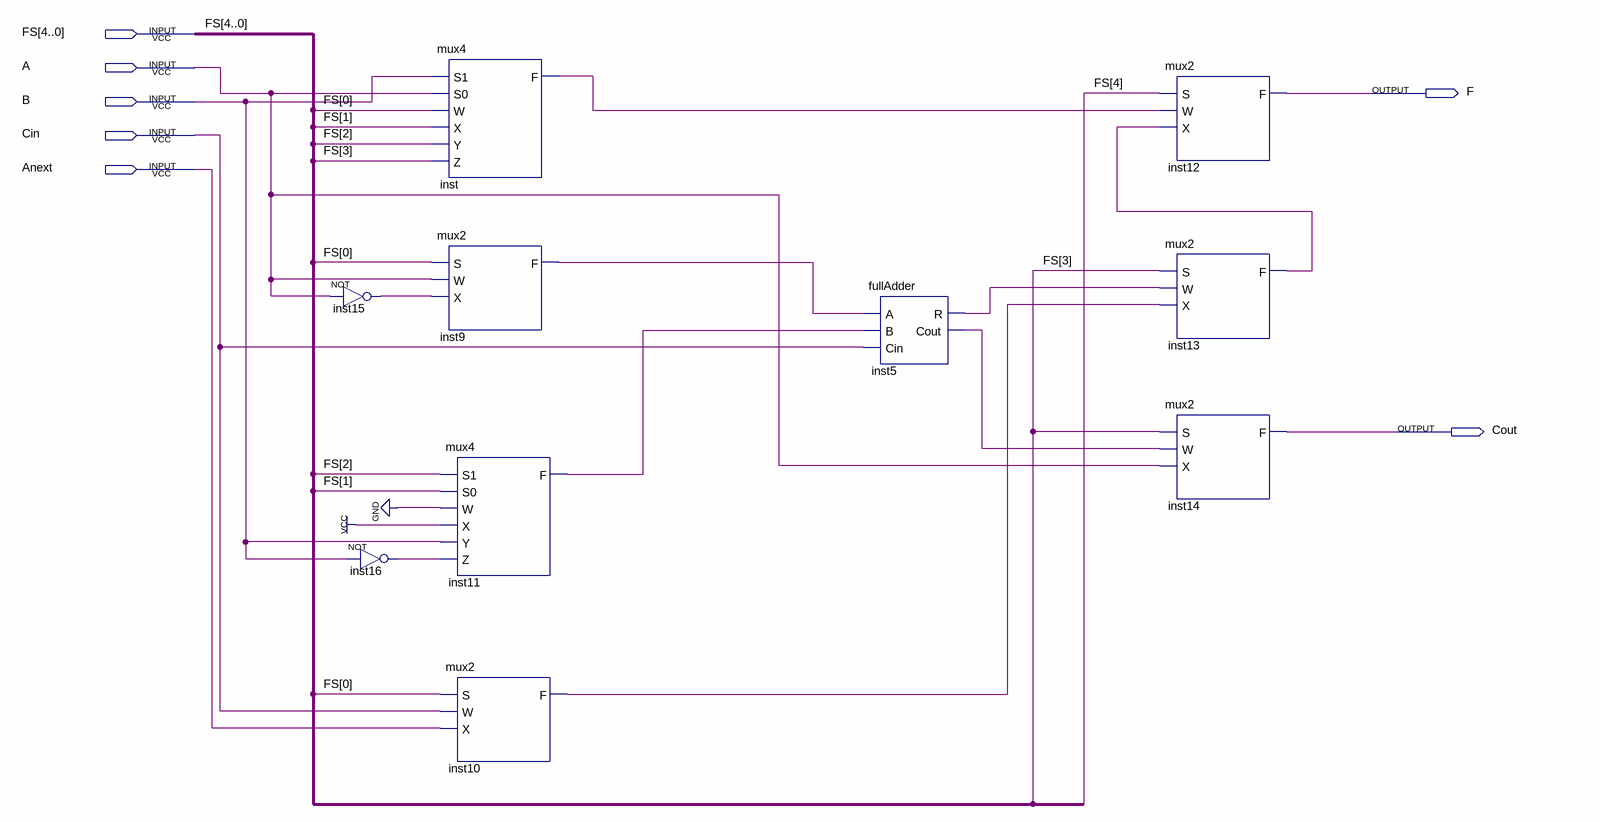
[diagram p0: schematic sheet]
// Quartus schematic ALUschem.bdf as structural Verilog: 10 symbols, 7 pins
module ALUschem (
  input  [4:0] FS,
  input  A,
  input  B,
  input  Cin,
  input  Anext,
  output F,
  output Cout
);

  wire inst5_cout, inst5_r, inst9_f, inst10_f, inst11_f, inst13_f, inst15_out, inst16_out, inst_f;

  not inst15 (inst15_out, A);
  not inst16 (inst16_out, B);
  mux4 inst (.S1(B), .S0(A), .W(FS[0]), .X(FS[1]), .Y(FS[2]), .Z(FS[3]), .F(inst_f));
  mux2 inst9 (.S(FS[0]), .W(A), .X(inst15_out), .F(inst9_f));
  mux4 inst11 (.S1(FS[2]), .S0(FS[1]), .W(1'b0), .X(1'b1), .Y(B), .Z(inst16_out), .F(inst11_f));
  mux2 inst10 (.S(FS[0]), .W(Cin), .X(Anext), .F(inst10_f));
  fullAdder inst5 (.A(inst9_f), .B(inst11_f), .Cin(Cin), .R(inst5_r), .Cout(inst5_cout));
  mux2 inst12 (.S(FS[4]), .W(inst_f), .X(inst13_f), .F(F));
  mux2 inst13 (.S(FS[3]), .W(inst5_r), .X(inst10_f), .F(inst13_f));
  mux2 inst14 (.S(FS[3]), .W(inst5_cout), .X(A), .F(Cout));
endmodule
